# EAGLE design 3002_serial_voltera (EAGLE 9.6.2)
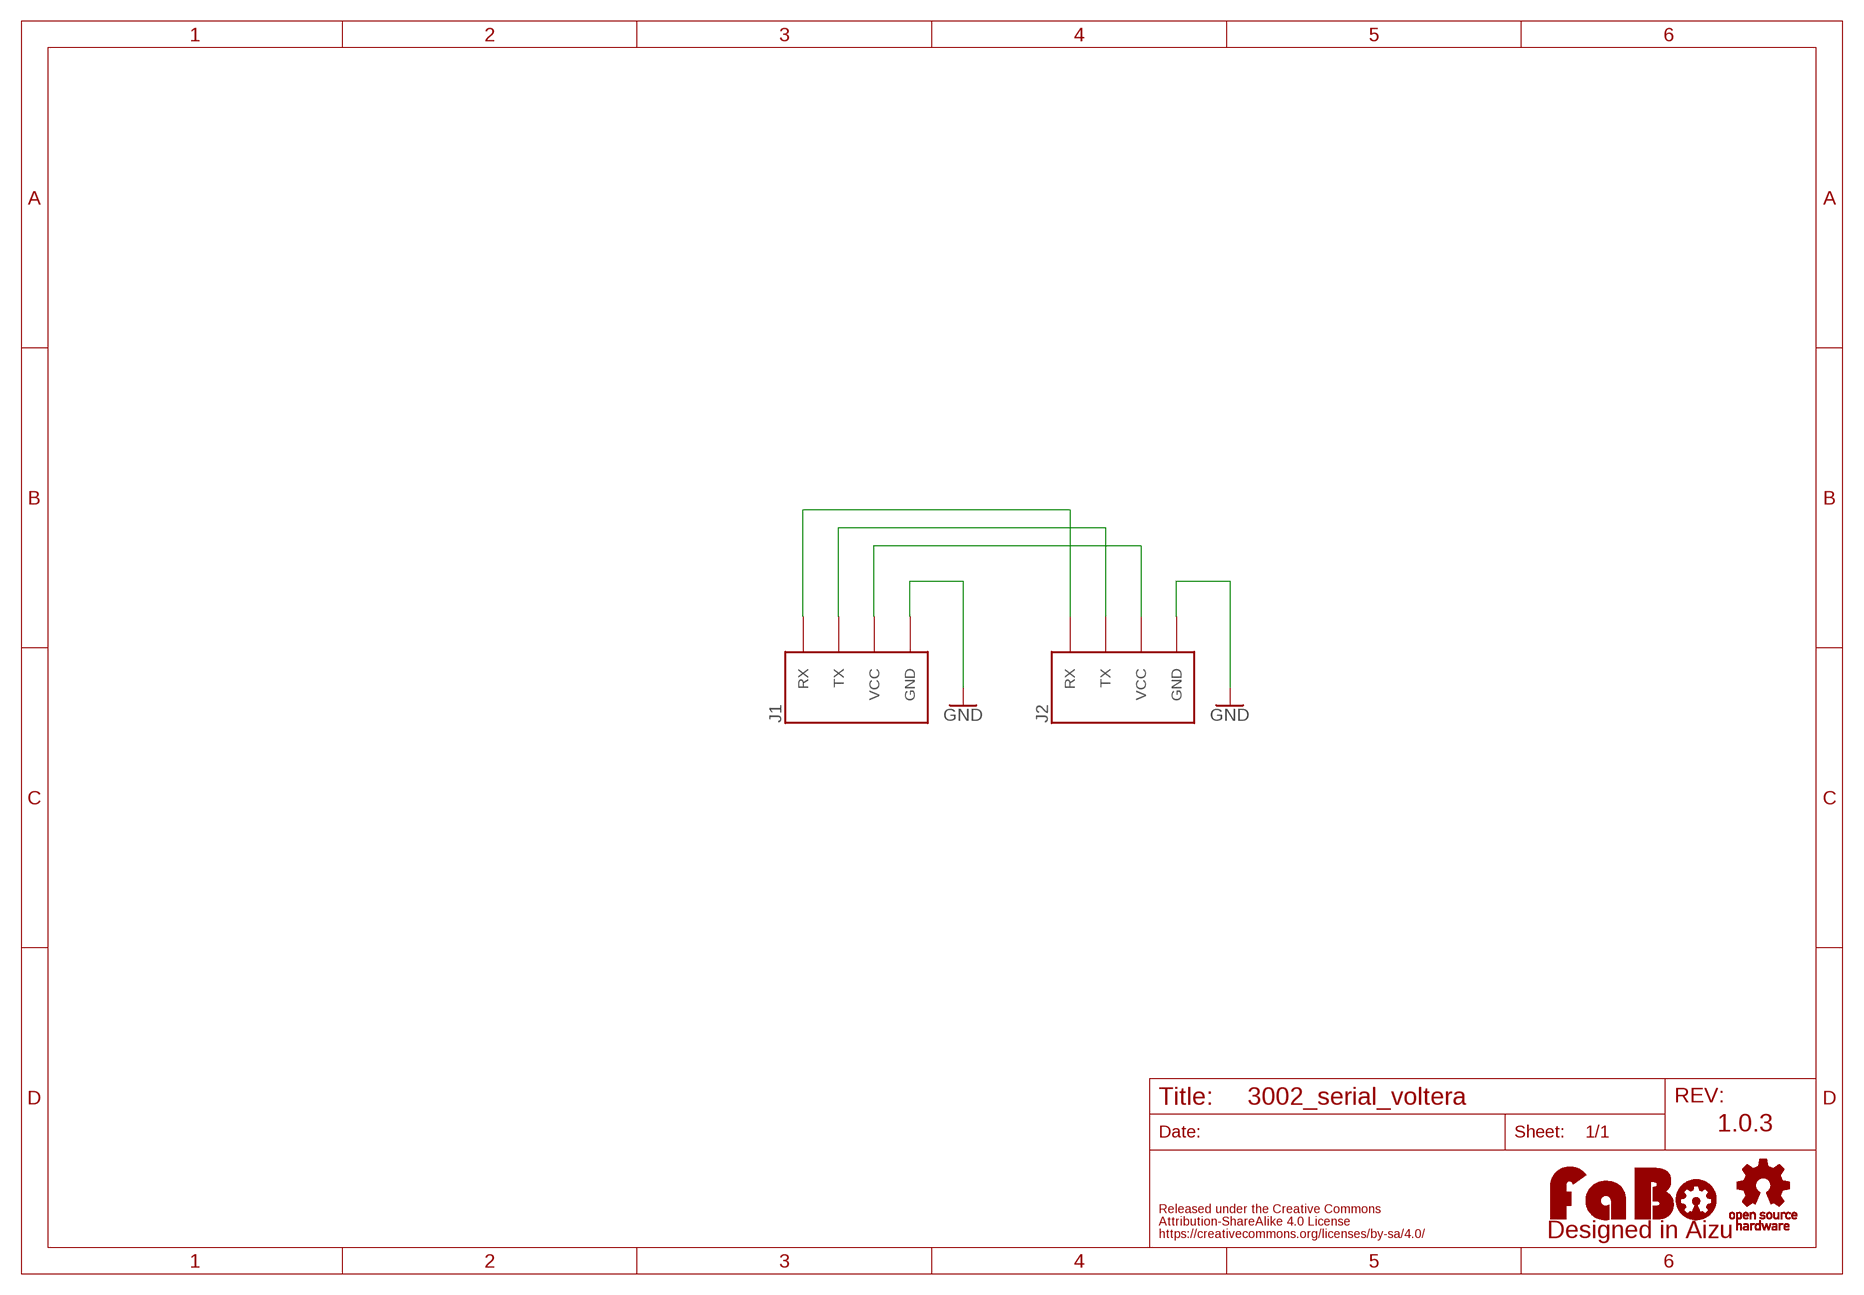
[diagram p0: schematic, sheet 1]

## Parts
J1  FABO_BRICK_SERIAL-VOLTERA_BASE  [FABO_BRICK_SERIAL_VOLTERA_BASE]
J2  FABO_BRICK_SERIAL-VOLTERA_PAD  [FABO_BRICK_SERIAL_VOLTERA_PAD]
U$2  LOGO_FABO-S  [LOGO_FABO_S]
U$3  LOGO_OSHW-M_BOTTOM  [LOGO_OSHW_M_BOTTOM]

## Nets
GND: J1.GND J2.GND
N$3: J1.VCC J2.VCC
N$4: J1.TX J2.TX
N$5: J1.RX J2.RX

## Notes on the sheet
- 1.0.3

## Library data of the parts
J1 J2 = FaBo-Template:FABO_BRICK_SERIAL: FaBo Brick Serial
U$2 = FaBo-Logo:LOGO_FABO
U$3 = FaBo-Logo:LOGO_OSHW

## Board
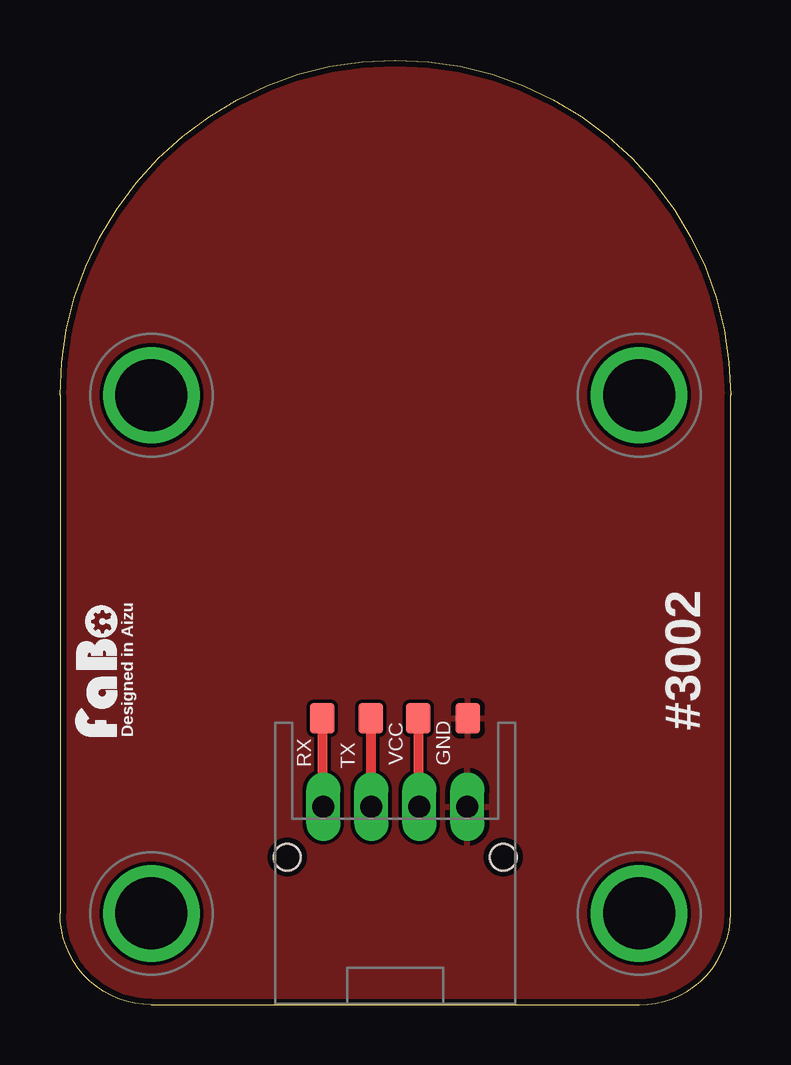
[diagram p1: board, top side]
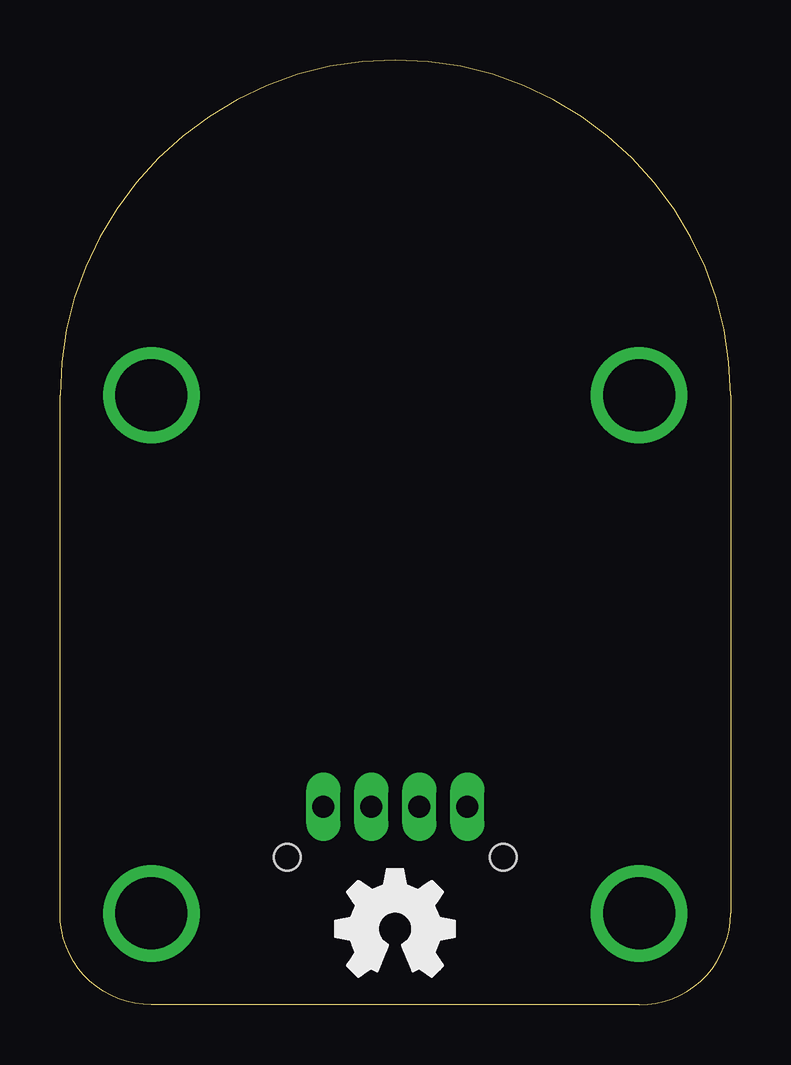
[diagram p2: board, bottom side, seen from below]

Size 27.94 x 39.37 mm. Coordinates in mm from the lower left corner, seen from the top.
Copper layers (1*16): Top 0.035mm / dielectric 1.6mm / Bottom 0.035mm
Design rules "PCBway": minimum track width 6mil, minimum drill 12mil, track to track 6mil, track to pad 6mil, pad to pad 6mil, via to via 6mil, smd to smd 6mil, copper to edge 10mil, drill to drill 10mil, minimum pad ring 10mil, minimum via ring 6mil, stop-mask expansion 2mil, vias tented up to drill 100mil, thermal gap 8mil

### Footprints (pad centres in the part's own frame; a part is rotated, then mirrored left to right if it is on the bottom)
FABO_BRICK_SERIAL_VOLTERA_BASE = drill 0.9 pad 1.422 long: GND 4.27,-10.795; RX -1.73,-10.795; TX 0.27,-10.795; VCC 2.27,-10.795 | drill 3 pad 3.81: P$1 -8.89,6.35; P$2 11.43,6.35; P$3 -8.89,-15.24; P$4 11.43,-15.24 | hole 1.1: -3.23,-12.895; 5.77,-12.895
FABO_BRICK_SERIAL_VOLTERA_PAD = smd 1.016 x 1.27: GND 4.293,-7.112; RX -1.778,-7.112; TX 0.254,-7.112; VCC 2.235,-7.112

### Placement (x,y rotation side)
J1  12.7,19.05 0 top
J2  12.7,19.05 0 top
U$2  2.54,13.97 90 top
U$3  13.97,3.17 0 top

### Tracks (layer width: path | path; a pad name or v marks a point on that pad's centre or on a via)
GND
  pour Top: 0,0 27.94,0 27.94,39.37 0,39.37
N$3
  Top 0.406: J2.VCC 14.94,8.29 J1.VCC
N$4
  Top 0.406: J2.TX 12.95,8.27 J1.TX
N$5
  Top 0.406: J2.RX 10.92,8.3 J1.RX

### Text on the board
tPlace: Designed in Aizu | #3002